# EAGLE design basic_duino (EAGLE 9.4.2)
CNAME: Microcontroller + Power + Headers; CREVISION: V1.0.0; DESIGNER: Kshitij Dadhekar
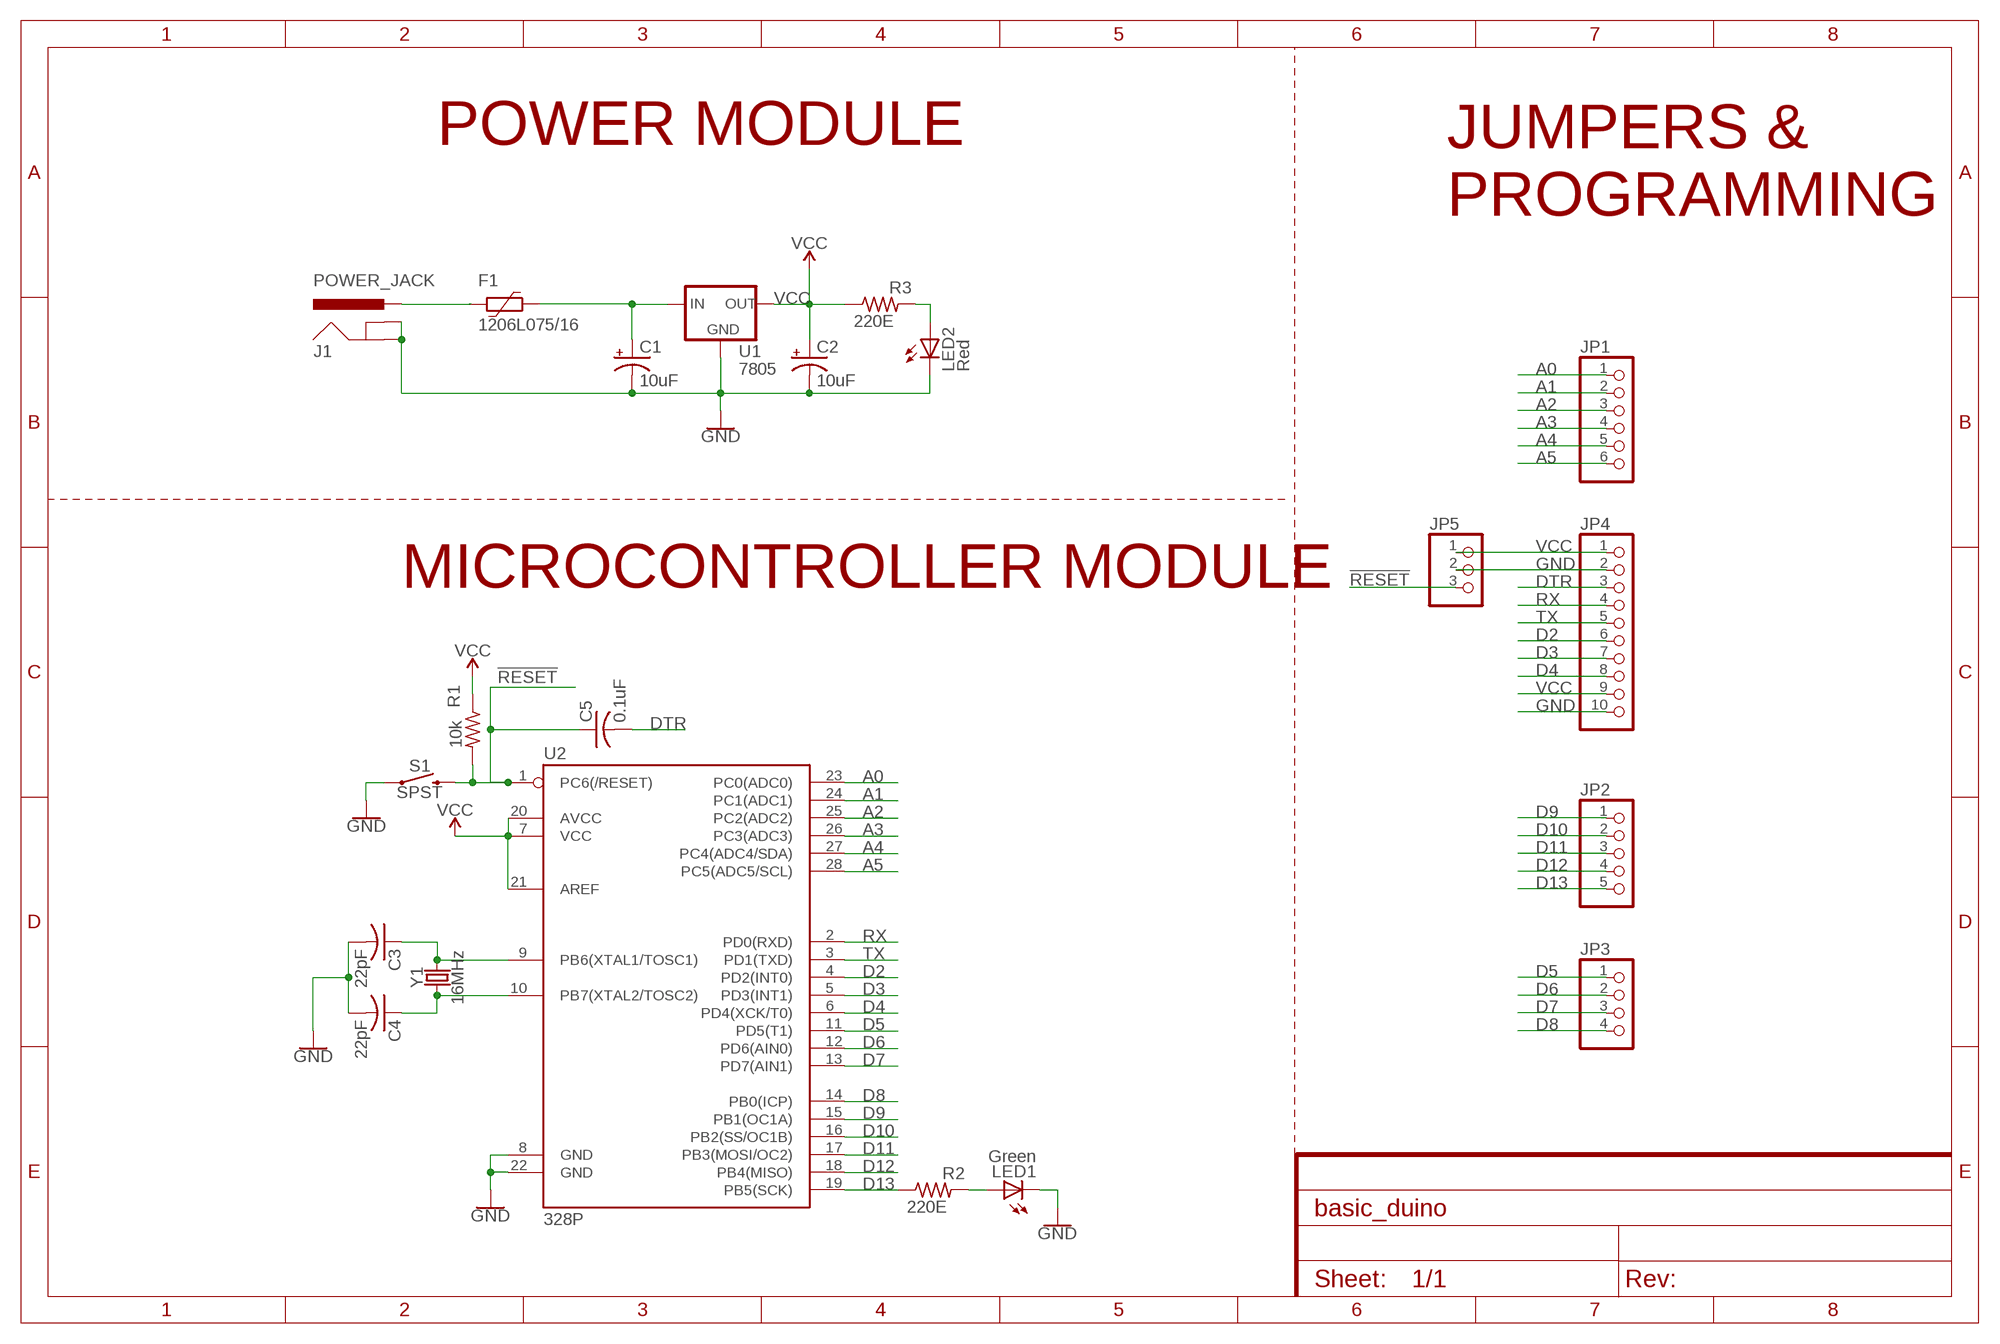
[diagram p0: schematic, sheet 1]

## Parts
C1  10uF  CPOL-USE2.5-6  [E2,5-6]
C2  10uF  CPOL-USE2.5-6  [E2,5-6]
C3  22pF  C-US025-025X050  [C025-025X050]
C4  22pF  C-US025-025X050  [C025-025X050]
C5  0.1uF  C-US025-025X050  [C025-025X050]
F1  1206L075/16  [1206L]
J1  POWER_JACK  [POWER_JACK_PTH]
JP1  PINHD-1X6  [1X06]
JP2  PINHD-1X5  [1X05]
JP3  PINHD-1X4  [1X04]
JP4  PINHD-1X10  [1X10]
JP5  PINHD-1X3  [1X03]
LED1  Green  LED3MM  [LED3MM]
LED2  Red  LED3MM  [LED3MM]
R1  10k  R-US_0204/7  [0204/7]
R2  220E  R-US_0204/7  [0204/7]
R3  220E  R-US_0204/7  [0204/7]
S1  SPST  MOMENTARY-SWITCH-SPST-PTH-6.0MM  [TACTILE_SWITCH_PTH_6.0MM]
U1  7805  78XXS  [78XXS]
U2  328P  ATMEGA328P_PDIP  [DIP28]
Y1  16MHz  CRYSTAL-16MHZPTH-HC49US  [HC49US]

## Nets
!RESET: C5.1 JP5.3 R1.2 S1.3 U2.1(PC6(/RESET))
A0: JP1.1 U2.23(PC0(ADC0))
A1: JP1.2 U2.24(PC1(ADC1))
A2: JP1.3 U2.25(PC2(ADC2))
A3: JP1.4 U2.26(PC3(ADC3))
A4: JP1.5 U2.27(PC4(ADC4/SDA))
A5: JP1.6 U2.28(PC5(ADC5/SCL))
D2: JP4.6 U2.4(PD2(INT0))
D3: JP4.7 U2.5(PD3(INT1))
D4: JP4.8 U2.6(PD4(XCK/T0))
D5: JP3.1 U2.11(PD5(T1))
D6: JP3.2 U2.12(PD6(AIN0))
D7: JP3.3 U2.13(PD7(AIN1))
D8: JP3.4 U2.14(PB0(ICP))
D9: JP2.1 U2.15(PB1(OC1A))
D10: JP2.2 U2.16(PB2(SS/OC1B))
D11: JP2.3 U2.17(PB3(MOSI/OC2))
D12: JP2.4 U2.18(PB4(MISO))
D13: JP2.5 R2.1 U2.19(PB5(SCK))
DTR: C5.2 JP4.3
GND: C1.- C2.- C3.2 C4.2 J1.GND J1.GNDBREAK JP4.2 JP4.10 JP5.2 LED1.K(C) LED2.K(C) S1.1 U1.GND U2.8(GND) U2.22(GND)
N$1: C1.+ F1.1 U1.IN
N$2: C3.1 U2.9(PB6(XTAL1/TOSC1)) Y1.2
N$3: C4.1 U2.10(PB7(XTAL2/TOSC2)) Y1.1
N$5: LED2.A R3.2
N$6: LED1.A R2.2
N$7: F1.2 J1.PWR
RX: JP4.4 U2.2(PD0(RXD))
TX: JP4.5 U2.3(PD1(TXD))
VCC: C2.+ JP4.1 JP4.9 JP5.1 R1.1 R3.1 U1.OUT U2.7(VCC) U2.20(AVCC) U2.21(AREF)

## Notes on the sheet
- POWER MODULE
- JUMPERS &
  PROGRAMMING
- MICROCONTROLLER MODULE

## Library data of the parts
C1 C2 = rcl:CPOL-US: POLARIZED CAPACITOR, American symbol; SPICEPREFIX: C
C3-C5 = rcl:C-US: CAPACITOR, American symbol; SPICEPREFIX: C
F1 = polyfuse-smd_10:?: Polyfuse Resettable PTC Source: http://www.littelfuse.com/products/resettable-ptcs.aspx; MF: Littelfuse; MPN: 1206L075/16; OC_FARNELL: unknown; OC_NEWARK: unknown
J1 = SparkFun-Connectors:POWER_JACK: Power Jack Connector This is the standard 5.5mm barrel jack for power. The PTH is the most common, proven, reliable, footprint. The Slot footprint only works if the mill layer is transmitted to the PCB fab house so be warned. Here are the connectors we sell at SparkFun: DC Barrel Power Jack/Connector <https://www.sparkfun.com/products/119> (PRT-00119) DC Barrel Power Jack/Connector (SMD) <https://www.sparkfun.com/products/12748> (PRT-12748) DC Barrel Jack Adapter - Breadboard Compatible <https://www.sparkfun.com/products/10811> (PRT-10811) It is used on this SparkFun product (and many, many others): SparkFun RedBoard - Programmed with Arduino <https://www.sparkfun.com/products/12757> (DEV-12757) Also, if you need a mating power supply or connector, please check these out: Wall Adapter Power Supply - 9VDC 650mA <https://www.sparkfun.com/products/298> (TOL-00298) DC Barrel Jack Adapter - Male <https://www.sparkfun.com/products/10287> (PRT-10287); PROD_ID: CONN-08197
JP1 = pinhead:PINHD-1X6: PIN HEADER
JP2 = pinhead:PINHD-1X5: PIN HEADER
JP3 = pinhead:PINHD-1X4: PIN HEADER
JP4 = pinhead:PINHD-1X10: PIN HEADER
JP5 = pinhead:PINHD-1X3: PIN HEADER
LED1 LED2 = led:LED: LED OSRAM: - CHIPLED LG R971, LG N971, LY N971, LG Q971, LY Q971, LO R971, LY R971 LH N974, LH R974 LS Q976, LO Q976, LY Q976 LO Q996 - Hyper CHIPLED LW Q18S LB Q993, LB Q99A, LB R99A - SideLED LS A670, LO A670, LY A670, LG A670, LP A670 LB A673, LV A673, LT A673, LW A673 LH A674 LY A675 LS A676, LA A676, LO A676, LY A676, LW A676 LS A679, LY A679, LG A679 - Hyper Micro SIDELED® LS Y876, LA Y876, LO Y876, LY Y876 LT Y87S - SmartLED LW L88C, LW L88S LB L89C, LB L89S, LG L890 LS L89K, LO L89K, LY L89K LS L896, LA L896, LO L896, LY L896 - TOPLED LS T670, LO T670, LY T670, LG T670, LP T670 LSG T670, LSP T670, LSY T670, LOP T670, LYG T670 LG T671, LOG T671, LSG T671 LB T673, LV T673, LT T673, LW T673 LH T674 LS T676, LA T676, LO T676, LY T676, LB T676, LH T676, LSB T676, LW T676 LB T67C, LV T67C, LT T67C, LS T67K, LO T67K, LY T67K, LW E67C LS E67B, LA E67B, LO E67B, LY E67B, LB E67C, LV E67C, LT E67C LW T67C LS T679, LY T679, LG T679 LS T770, LO T770, LY T770, LG T770, LP T770 LB T773, LV T773, LT T773, LW T773 LH T774 LS E675, LA E675, LY E675, LS T675 LS T776, LA T776, LO T776, LY T776, LB T776 LHGB T686 LT T68C, LB T68C - Hyper Mini TOPLED® LB M676 - Mini TOPLED Santana® LG M470 LS M47K, LO M47K, LY M47K Source: http://www.osram.convergy.de LUXEON: - LUMILED® LXK2-PW12-R00, LXK2-PW12-S00, LXK2-PW14-U00, LXK2-PW14-V00 LXK2-PM12-R00, LXK2-PM12-S00, LXK2-PM14-U00 LXK2-PE12-Q00, LXK2-PE12-R00, LXK2-PE12-S00, LXK2-PE14-T00, LXK2-PE14-U00 LXK2-PB12-K00, LXK2-PB12-L00, LXK2-PB12-M00, LXK2-PB14-N00, LXK2-PB14-P00, LXK2-PB14-Q00 LXK2-PR12-L00, LXK2-PR12-M00, LXK2-PR14-Q00, LXK2-PR14-R00 LXK2-PD12-Q00, LXK2-PD12-R00, LXK2-PD12-S00 LXK2-PH12-R00, LXK2-PH12-S00 LXK2-PL12-P00, LXK2-PL12-Q00, LXK2-PL12-R00 Source: www.luxeon.com KINGBRIGHT: KA-3528ASYC Source: www.kingbright.com
R1-R3 = rcl:R-US_: RESISTOR, American symbol; SPICEPREFIX: R
S1 = SparkFun-Switches:MOMENTARY-SWITCH-SPST: Momentary Switch (Pushbutton) - SPST Normally-open (NO) SPST momentary switches (buttons, pushbuttons). Variants PTH-12MM - 12mm square, through-hole Momentary Pushbutton Switch - 12mm Square <https://www.sparkfun.com/products/9190> (COM-09190) PTH-6.0MM, PTH-6.0MM-KIT - 6.0mm square, through-hole Mini Pushbutton Switch <https://www.sparkfun.com/products/97> (COM-00097) KIT package intended for soldering kit's - only one side of pads' copper is exposed. PTH-RIGHT-ANGLE-KIT - Right-angle, through-hole Right Angle Tactile Button <https://www.sparkfun.com/products/10791> - Used on SparkFun BigTime Watch Kit <https://www.sparkfun.com/products/11734> SMD-12MM - 12mm square, surface-mount Tactile Button - SMD (12mm) <https://www.sparkfun.com/products/12993> (COM-12993) Used on SparkFun PicoBoard <https://www.sparkfun.com/products/11888> SMD-4.5MM - 4.5mm Square Trackball Switch Used on SparkFun Blackberry Trackballer Breakout <https://www.sparkfun.com/products/13169> SMD-4.6MMX2.8MM - 4.60mm x 2.80mm, surface mount Used on SparkFun SAMD21 Mini Breakout <https://www.sparkfun.com/products/13664> SMD-5.2MM, SMD-5.2-REDUNDANT - 5.2mm square, surface-mount Mini Pushbutton Switch - SMD <https://www.sparkfun.com/products/8720> (COM-08720) Used on Arduino Pro Mini <https://www.sparkfun.com/products/11114> REDUNDANT package connects both switch circuits together SMD-6.0X3.5MM - 6.0 x 3.5mm, surface mount Momentary Reset Switch SMD <https://www.sparkfun.com/products/8229> (COM-08229) SMD-6.2MM-TALL - 6.2mm square, surface mount Tactile Button - SMD (6mm) <https://www.sparkfun.com/products/12992> Used on SparkFun Digital Sandbox <https://www.sparkfun.com/products/12651> SMD-RIGHT-ANGLE - Right-angle, surface mount Used on SparkFun Block for Intel® Edison - Arduino <https://www.sparkfun.com/products/13036>; PROD_ID: SWCH-08441; SF_SKU: COM-00097
U1 = v-reg:78XXS: VOLTAGE REGULATOR
U2 = SparkFun-IC-Microcontroller:ATMEGA328P_PDIP: Atmel 328P Through hole ATMEGA328P uC used in the Arduino 32kb flash, 1k EEPROM, 2k SRAM Datasheet <http://www.sparkfun.com/datasheets/Components/SMD/ATMega328.pdf> SparkFun Products Storefront component: AVR 28 Pin 20MHz 32K 6A/D - ATMega328P <https://www.sparkfun.com/products/9061> (COM-09061) SparkFun Simon Says - Through-Hole Soldering Kit <https://www.sparkfun.com/products/10547> (KIT-10547) SparkFun Learn to Solder - Simon Says <https://www.sparkfun.com/products/13708> (KIT-13708) SparkFun BigTime Watch Kit <https://www.sparkfun.com/products/11734> (KIT-11734) SparkFun ClockIt <https://www.sparkfun.com/products/10930> (KIT-10930) SparkFun Serial Enabled LCD Kit <https://www.sparkfun.com/products/10097> (LCD-10097) SparkFun Simon Tilts - Through Hole Soldering Kit <https://www.sparkfun.com/products/12634> (KIT-12634) SparkFun Frequency Counter Kit <https://www.sparkfun.com/products/10140> (KIT-10140) FabFM Radio Kit <https://www.sparkfun.com/products/11043> (KIT-11043) SparkFun Binary Blaster Kit <https://www.sparkfun.com/products/12037> (KIT-12037) SparkFun Metro-Gnome <https://www.sparkfun.com/products/9236> (KIT-09236) ATmega328 with Arduino Optiboot (Uno) <https://www.sparkfun.com/products/10524> (DEV-10524); PROD_ID: IC-09136
Y1 = SparkFun-Clocks:CRYSTAL-16MHZ: 16MHz Crystal Digikey Example <http://www.digikey.com/product-search/en?keywords=535-9122-1-ND> Frequency: 16MHz Frequency Stability: ±50ppm Frequency Tolerance: ±20ppm Load Capacitance: 18pF SparkFun Products: Pro Micro -5V/16MHz <https://www.sparkfun.com/products/12640> SparkFun Serial Enabled LCD Kit <https://www.sparkfun.com/products/10097>; PROD_ID: XTAL-08181; SF_ID: COM-00536

## Board
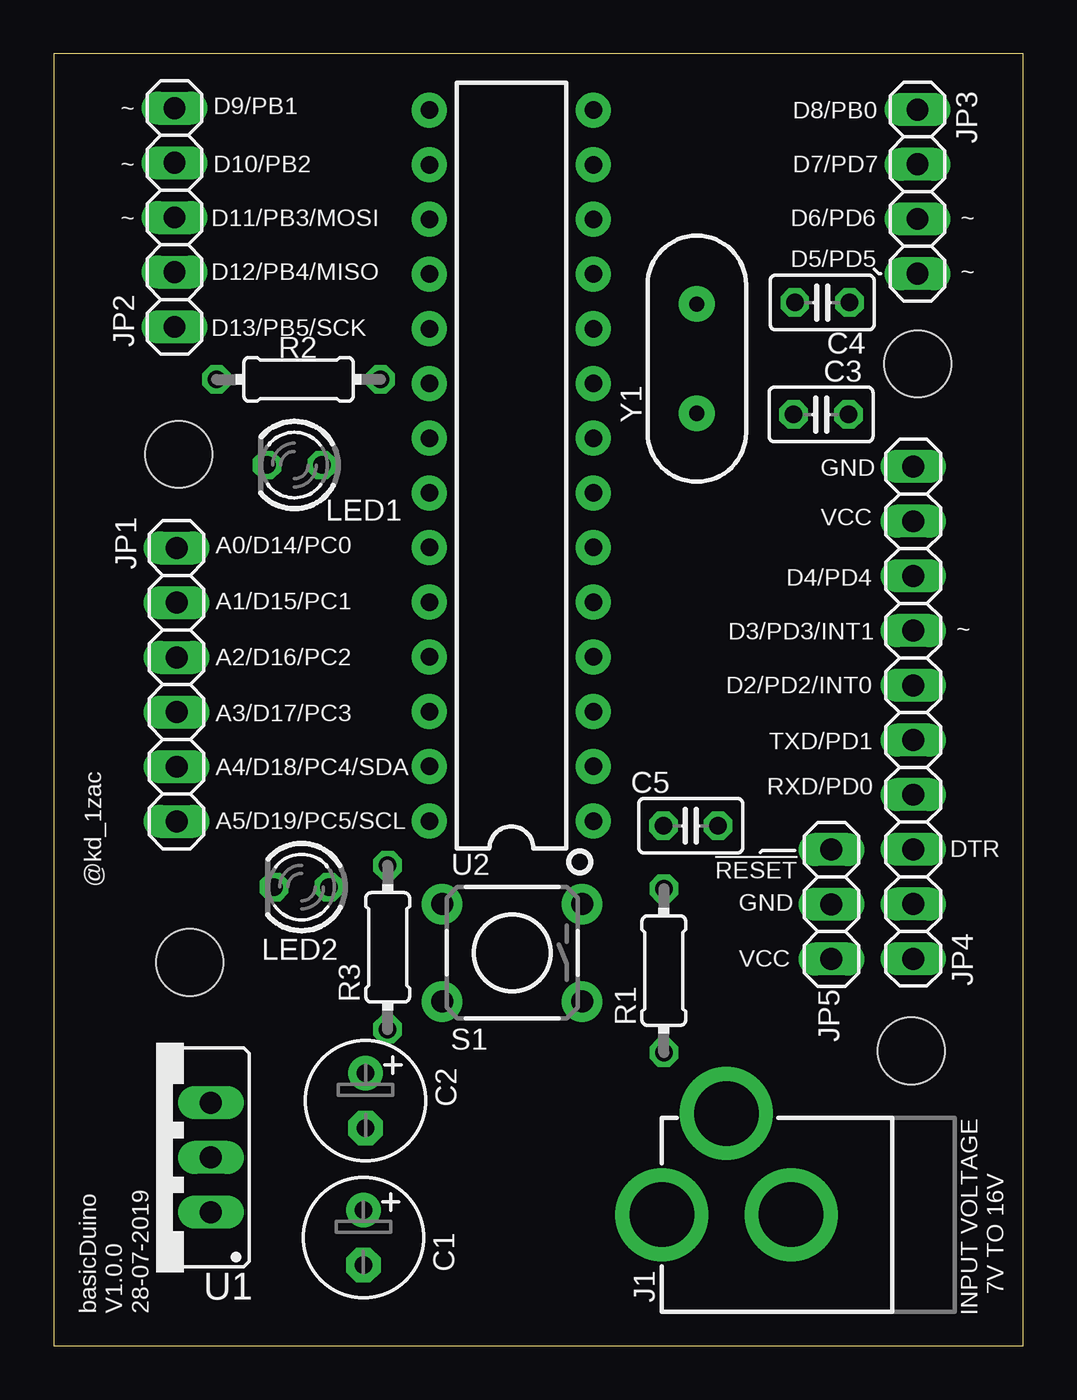
[diagram p1: board, top side]
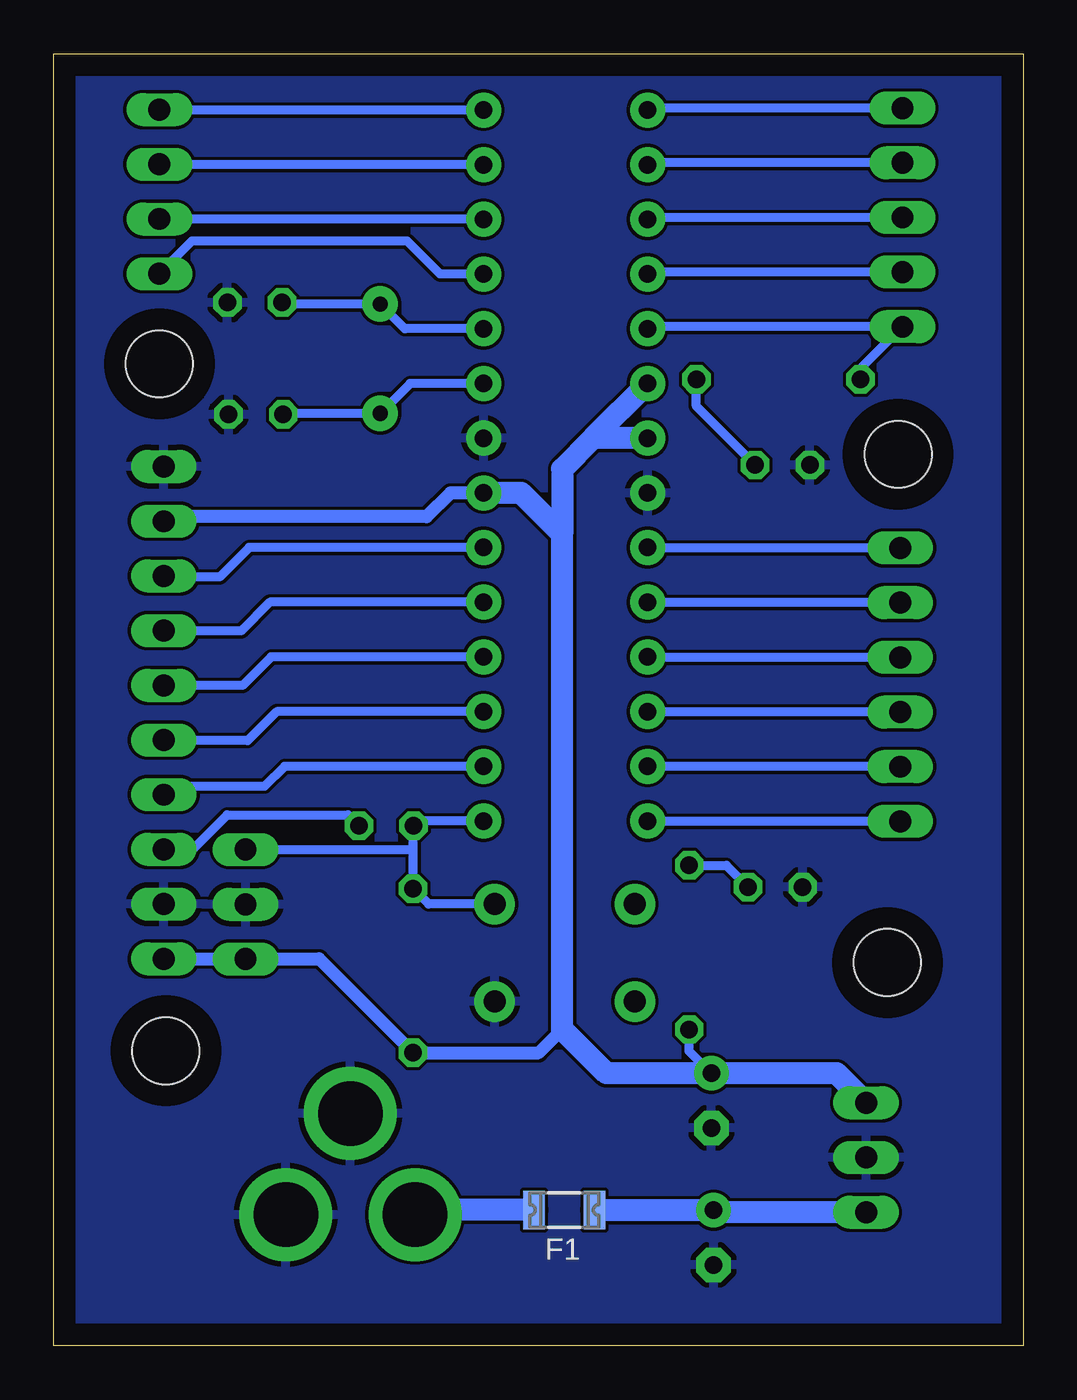
[diagram p2: board, bottom side, seen from below]

Size 45 x 60 mm. Coordinates in mm from the lower left corner, seen from the top.
Outline: 0,0 45,0 45,60 0,60 0,0
Copper layers (1*16): Top 0.035mm / dielectric 1.5mm / Bottom 0.035mm
Design rules "default": minimum track width 6mil, minimum drill 0.35mm, track to track 6mil, track to pad 6mil, pad to pad 6mil, via to via 6mil, smd to smd 6mil, copper to edge 40mil, drill to drill 6mil, minimum pad ring 10mil, minimum via ring 8mil, stop-mask expansion 4mil, vias tented up to drill 0mil, thermal gap 10mil
Holes 3.1 mm at 39.8,13.7 40.1,45.6 5.8,41.4 6.3,17.8

### Footprints (pad centres in the part's own frame; a part is rotated, then mirrored left to right if it is on the bottom)
E2,5-6 = drill 0.813 pad 1.6: + -1.27,0 | drill 0.813 pad 1.6 octagon: - 1.27,0
C025-025X050 = drill 0.813 octagon: 1 -1.27,0; 2 1.27,0
1206L = smd 1 x 1.8: 1 -1.4,0; 2 1.4,0
POWER_JACK_PTH = drill 2.997 pad 4.318: GND 0,7.7; GNDBREAK 4.7,10.7; PWR 0,13.7
1X06 = drill 1.016 long: 1 -6.35,0; 2 -3.81,0; 3 -1.27,0; 4 1.27,0; 5 3.81,0; 6 6.35,0
1X05 = drill 1.016 long: 1 -5.08,0; 2 -2.54,0; 3 0,0; 4 2.54,0; 5 5.08,0
1X04 = drill 1.016 long: 1 -3.81,0; 2 -1.27,0; 3 1.27,0; 4 3.81,0
1X10 = drill 1.016 long: 1 -11.43,0; 2 -8.89,0; 3 -6.35,0; 4 -3.81,0; 5 -1.27,0; 6 1.27,0; 7 3.81,0; 8 6.35,0; 9 8.89,0; 10 11.43,0
1X03 = drill 1.016 long: 1 -2.54,0; 2 0,0; 3 2.54,0
LED3MM = drill 0.813 octagon: A -1.27,0; K 1.27,0
0204/7 = drill 0.813 octagon: 1 -3.81,0; 2 3.81,0
TACTILE_SWITCH_PTH_6.0MM = drill 1.016 pad 1.88: 1 -3.251,2.261; 2 3.251,2.261; 3 -3.251,-2.261; 4 3.251,-2.261
78XXS = drill 1.016 long: GND 0,-2.54; IN -2.54,-2.54; OUT 2.54,-2.54
DIP28 = drill 0.813 pad 1.626: 1 -16.51,-3.81; 2 -13.97,-3.81; 3 -11.43,-3.81; 4 -8.89,-3.81; 5 -6.35,-3.81; 6 -3.81,-3.81; 7 -1.27,-3.81; 8 1.27,-3.81; 9 3.81,-3.81; 10 6.35,-3.81; 11 8.89,-3.81; 12 11.43,-3.81; 13 13.97,-3.81; 14 16.51,-3.81; 15 16.51,3.81; 16 13.97,3.81; 17 11.43,3.81; 18 8.89,3.81; 19 6.35,3.81; 20 3.81,3.81; 21 1.27,3.81; 22 -1.27,3.81; 23 -3.81,3.81; 24 -6.35,3.81; 25 -8.89,3.81; 26 -11.43,3.81; 27 -13.97,3.81; 28 -16.51,3.81
HC49US = drill 0.7 pad 1.651: 1 -2.54,0; 2 2.54,0

### Placement (x,y rotation side)
C1  14.37,5.02 270 top
C2  14.47,11.38 270 top
C3  35.62,43.25 0 top
C4  35.67,48.45 0 top
C5  29.57,24.15 0 top
F1  21.3,6.3 180 bottom
J1  41.93,6.08 90 top
JP1  5.7,30.7 270 top
JP2  5.6,52.4 270 top
JP3  40.1,53.6 90 top
JP4  39.9,29.4 90 top
JP5  36.1,20.5 90 top
LED1  11.17,40.9 180 top
LED2  11.5,21.3 180 top
R1  28.32,17.42 90 top
R2  11.36,44.88 0 top
R3  15.5,18.5 90 top
S1  21.28,18.25 180 top
U1  4.75,8.74 90 top
U2  21.24,40.88 90 top
Y1  29.85,45.84 270 top

### Tracks (layer width: path | path; a pad name or v marks a point on that pad's centre or on a via)
!RESET
  Bottom 0.305: 28.36,23.04 28.32,23
  Bottom 0.406: U2.1 28.08,24.37 C5.1 28.32,24.13 28.32,23 R1.2 27.6,20.51 S1.3 | JP5.3 28.36,23.04
A0
  Bottom 0.406: JP1.1 17.41,37.05 U2.23
A1
  Bottom 0.406: JP1.2 17.41,34.51 U2.24
A2
  Bottom 0.406: JP1.3 17.41,31.97 U2.25
A3
  Bottom 0.406: JP1.4 17.41,29.43 U2.26
A4
  Bottom 0.406: JP1.5 17.41,26.89 U2.27
A5
  Bottom 0.406: JP1.6 17.41,24.35 U2.28
D2
  Bottom 0.406: U2.4 34.91,31.99 36.23,30.67 JP4.6
D3
  Bottom 0.406: U2.5 34.97,34.53 36.3,33.2 JP4.7
D4
  Bottom 0.406: U2.6 35.93,37.07 37.3,35.7 39.85,35.7 JP4.8
D5
  Bottom 0.406: U2.11 27.07,49.77 28.6,51.3 38.59,51.3 JP3.1
D6
  Bottom 0.406: U2.12 40.08,52.31 JP3.2
D7
  Bottom 0.406: U2.13 40.08,54.85 JP3.3
D8
  Bottom 0.406: U2.14 40.08,57.39 JP3.4
D9
  Bottom 0.406: JP2.1 17.34,57.48 U2.15
D10
  Bottom 0.406: JP2.2 17.34,54.94 U2.16
D11
  Bottom 0.406: JP2.3 17.34,52.4 U2.17
D12
  Bottom 0.406: U2.18 17.34,49.86 JP2.4
D13
  Bottom 0.406: U2.19 17.34,47.32 JP2.5 7.55,45.37 R2.1
DTR
  Bottom 0.406: C5.2 31.34,24.65 36.95,24.65 38.55,23.05 JP4.3
GND
  pour Bottom: 0,0 45,0 45,59.9 0,59.9
N$1
  Bottom 1.016: U1.IN 14.46,6.2 C1.+ F1.1
N$2
  Bottom 0.406: U2.9 28.46,44.69 Y1.2 34.3,43.3 C3.1
N$3
  Bottom 0.406: U2.10 28.7,47.23 Y1.1 34.33,48.38 C4.1
N$5
  Bottom 0.406: LED2.A 13.78,22.31 R3.2
N$6
  Bottom 0.406: LED1.A 15.17,43.63 R2.2
N$7
  Bottom 1.016: F1.2 28.01,6.3 J1.PWR
RX
  Bottom 0.406: U2.2 34.29,26.91 35.21,25.99 39.5,25.99 JP4.4
TX
  Bottom 0.406: U2.3 34.65,29.45 36,28.1 39.87,28.1 JP4.5
VCC
  Bottom 0.305: JP5.1 32.68,17.97
  Bottom 0.406: C2.+ 15.5,13.68 R3.1
  Bottom 0.61: U2.7 26.59,39.61 27.7,38.5 39.69,38.5 JP4.9 | 21.4,14.7 22.49,13.61 R1.1 32.68,17.97 JP4.1
  Bottom 1.016: U1.OUT 8.66,12.65 C2.+ 19.35,12.65 21.4,14.7 21.4,37.7 | 21.4,37.7 23.31,39.61 U2.7 | U2.20 19.97,42.15 | 19.97,42.15 21.4,40.72 21.4,37.7 | U2.21 19.97,42.15

### Text on the board
_tsilk: ~ | D9/PB1 | D8/PB0 | ~ | D10/PB2 | D7/PD7 | ~ | D11/PB3/MOSI | D6/PD6 | ~ | D12/PB4/MISO | D5/PD5 | ~ | D13/PB5/SCK | GND | VCC | A0/D14/PC0 | D4/PD4 | A1/D15/PC1 | D3/PD3/INT1 | ~ | A2/D16/PC2 | D2/PD2/INT0 | A3/D17/PC3 | TXD/PD1 | A4/D18/PC4/SDA | RXD/PD0 | A5/D19/PC5/SCL | DTR | !RESET | @kd_1zac | GND | VCC | basicDuino / V1.0.0 / 28-07-2019 | INPUT VOLTAGE / 7V TO 16V